# EasyEDA schematic EasyEDA_export.json
TITLE: New Schematic; REV: 1.0; Date: 2019-01-05; Sheet: 1/1; Drawn By: nanook
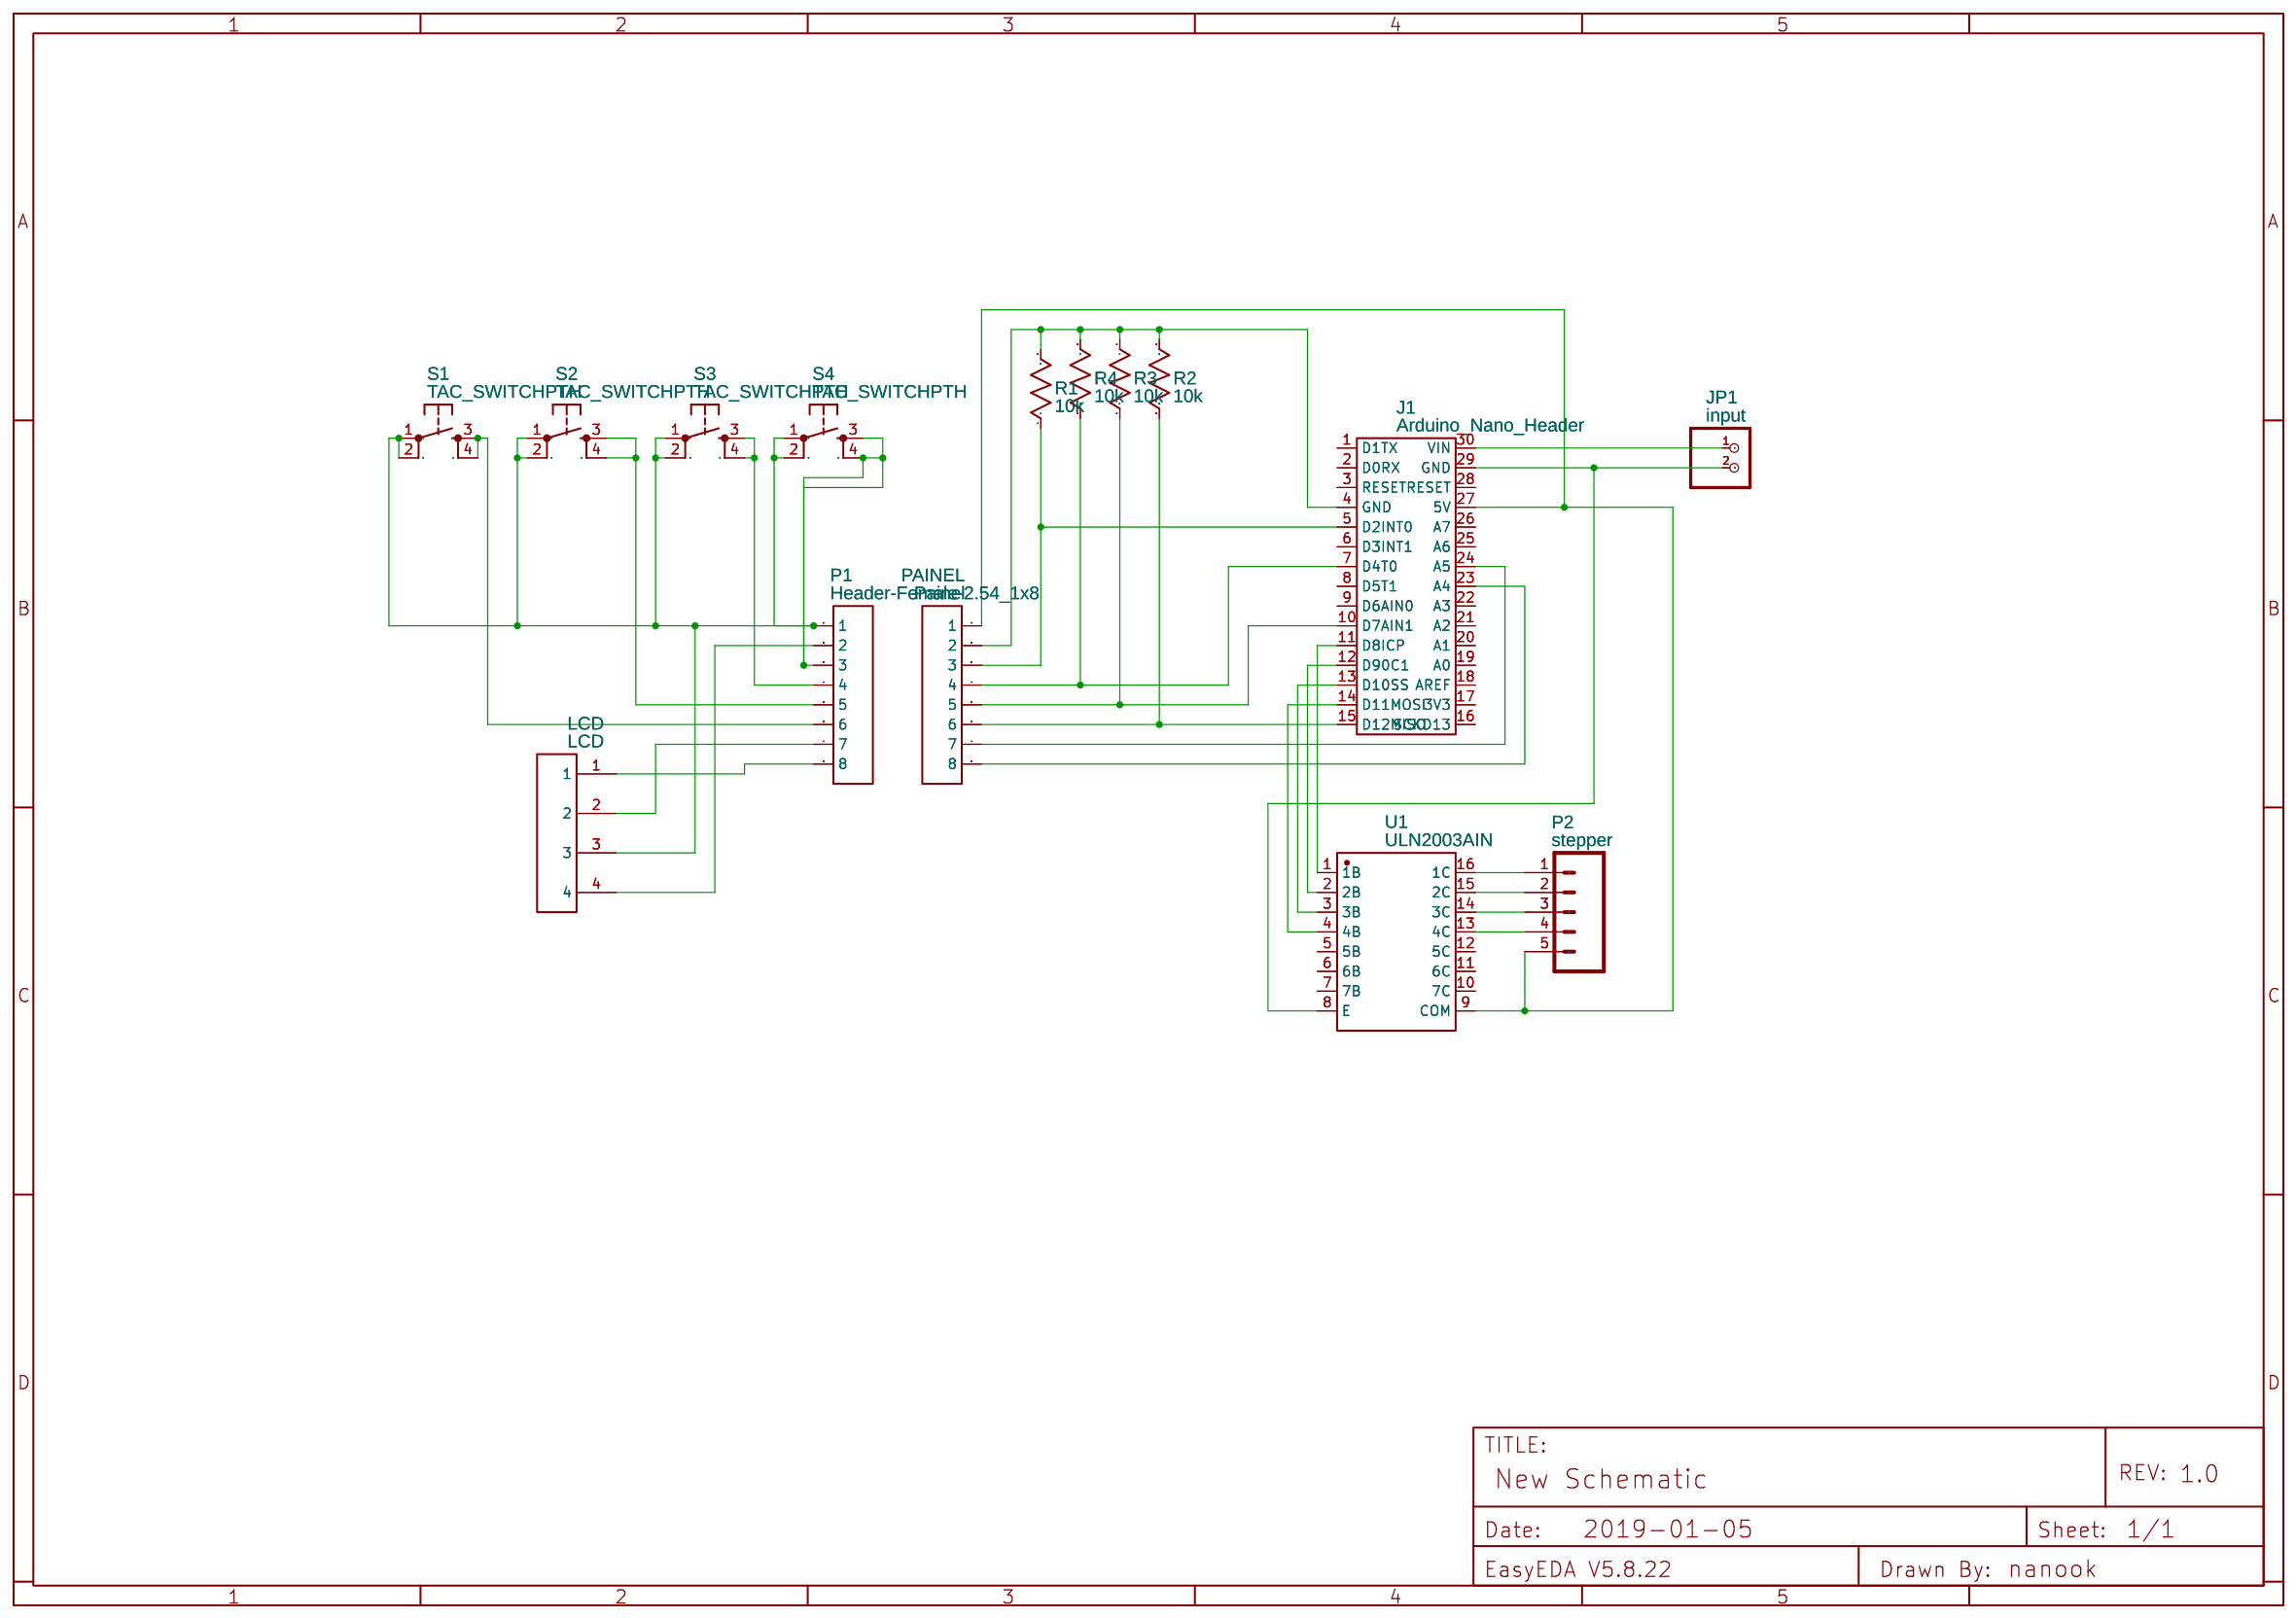
[diagram p0: schematic sheet]

## Parts
J1  Arduino_Nano_Header  [ARDUINO_NANO]
JP1  input  [1X02]
LCD  LCD  [4 PIN 2.54MM]
P1  Header-Female-2.54_1x8  [HDR-8X1/2.54]
P2  stepper  [JST_XH_1X05_2.50MM_THM]
PAINEL  Painel  [HDR-8X1/2.54]
R1  10k  [AXIAL-0.3]
R2  10k  [AXIAL-0.3]
R3  10k  [AXIAL-0.3]
R4  10k  [AXIAL-0.3]
S1  TAC_SWITCHPTH  [TACTILE-PTH]
S2  TAC_SWITCHPTH  [TACTILE-PTH]
S3  TAC_SWITCHPTH  [TACTILE-PTH]
S4  TAC_SWITCHPTH  [TACTILE-PTH]
U1  ULN2003AIN  [PDIP-16]

## Library data of the parts
J1 = -: Manufacturer Part: ?
JP1 = -: Contributor: sebby; Manufacturer Part: ?
LCD = -: Manufacturer Part: ?; Supplier Part: undefined; Contributor: danger.verma
P1 PAINEL = -: Supplier: LCSC; Manufacturer: BOOMELE; Manufacturer Part: Female headerHDR1X8-2.54; Supplier Part: C27438
P2 = -: sourceId: Y4gQNLJH3; Supplier Part: 455-2270-ND; Supplier: Digi-Key; Manufacturer Part: ?
R1-R4 = Res_AXIAL-0.3(1/8W)_US: Manufacturer Part: ?
S1-S4 = -: Momentary Switch; Contributor: SparkFun; Manufacturer Part: ?
U1 = -: Supplier: LCSC; Supplier Part: C90838; Manufacturer: Texas Instruments; Contributor: LCSC

## Nets
Net-(J1-4): J1.4(GND) PAINEL.2 R1.2 R2.1 R3.1 R4.1
Net-(J1-5): J1.5(D2INT0) PAINEL.3 R1.1
Net-(J1-7): J1.7(D4T0) PAINEL.4 R4.2
Net-(J1-10): J1.10(D7AIN1) PAINEL.5 R3.2
Net-(J1-11): J1.11(D8ICP) U1.1(1B)
Net-(J1-12): J1.12(D90C1) U1.2(2B)
Net-(J1-13): J1.13(D10SS) U1.3(3B)
Net-(J1-14): J1.14(D11MOSI) U1.4(4B)
Net-(J1-15): J1.15(D12MISO) PAINEL.6 R2.2
Net-(J1-23): J1.23(A4) PAINEL.8
Net-(J1-24): J1.24(A5) PAINEL.7
Net-(J1-27): J1.27(5V) P2.5 PAINEL.1 U1.9(COM)
Net-(J1-29): J1.29(GND) JP1.2 U1.8(E)
Net-(J1-30): J1.30(VIN) JP1.1
Net-(LCD-1): LCD.1 P1.8
Net-(LCD-2): LCD.2 P1.7
Net-(LCD-3): LCD.3 P1.1 S1.1 S1.2 S2.1 S2.2 S3.1 S3.2 S4.1 S4.2
Net-(LCD-4): LCD.4 P1.2
Net-(P1-3): P1.3 S4.3 S4.4
Net-(P1-4): P1.4 S3.3 S3.4
Net-(P1-5): P1.5 S2.3 S2.4
Net-(P1-6): P1.6 S1.3 S1.4
Net-(P2-1): P2.1 U1.16(1C)
Net-(P2-2): P2.2 U1.15(2C)
Net-(P2-3): P2.3 U1.14(3C)
Net-(P2-4): P2.4 U1.13(4C)

Not connected (* = marked no-connect by the designer): J1 1(D1TX) 2(D0RX) 3(RESET) 6(D3INT1) 8(D5T1) 9(D6AIN0) 16(SCKD13) 17(3V3) 18(AREF) 19(A0) 20(A1) 21(A2) 22(A3) 25(A6) 26(A7) 28(RESET); U1 5(5B) 6(6B) 7(7B) 10(7C) 11(6C) 12(5C)
